# Altium schematic sheet TMTGP.SchDoc
size A3
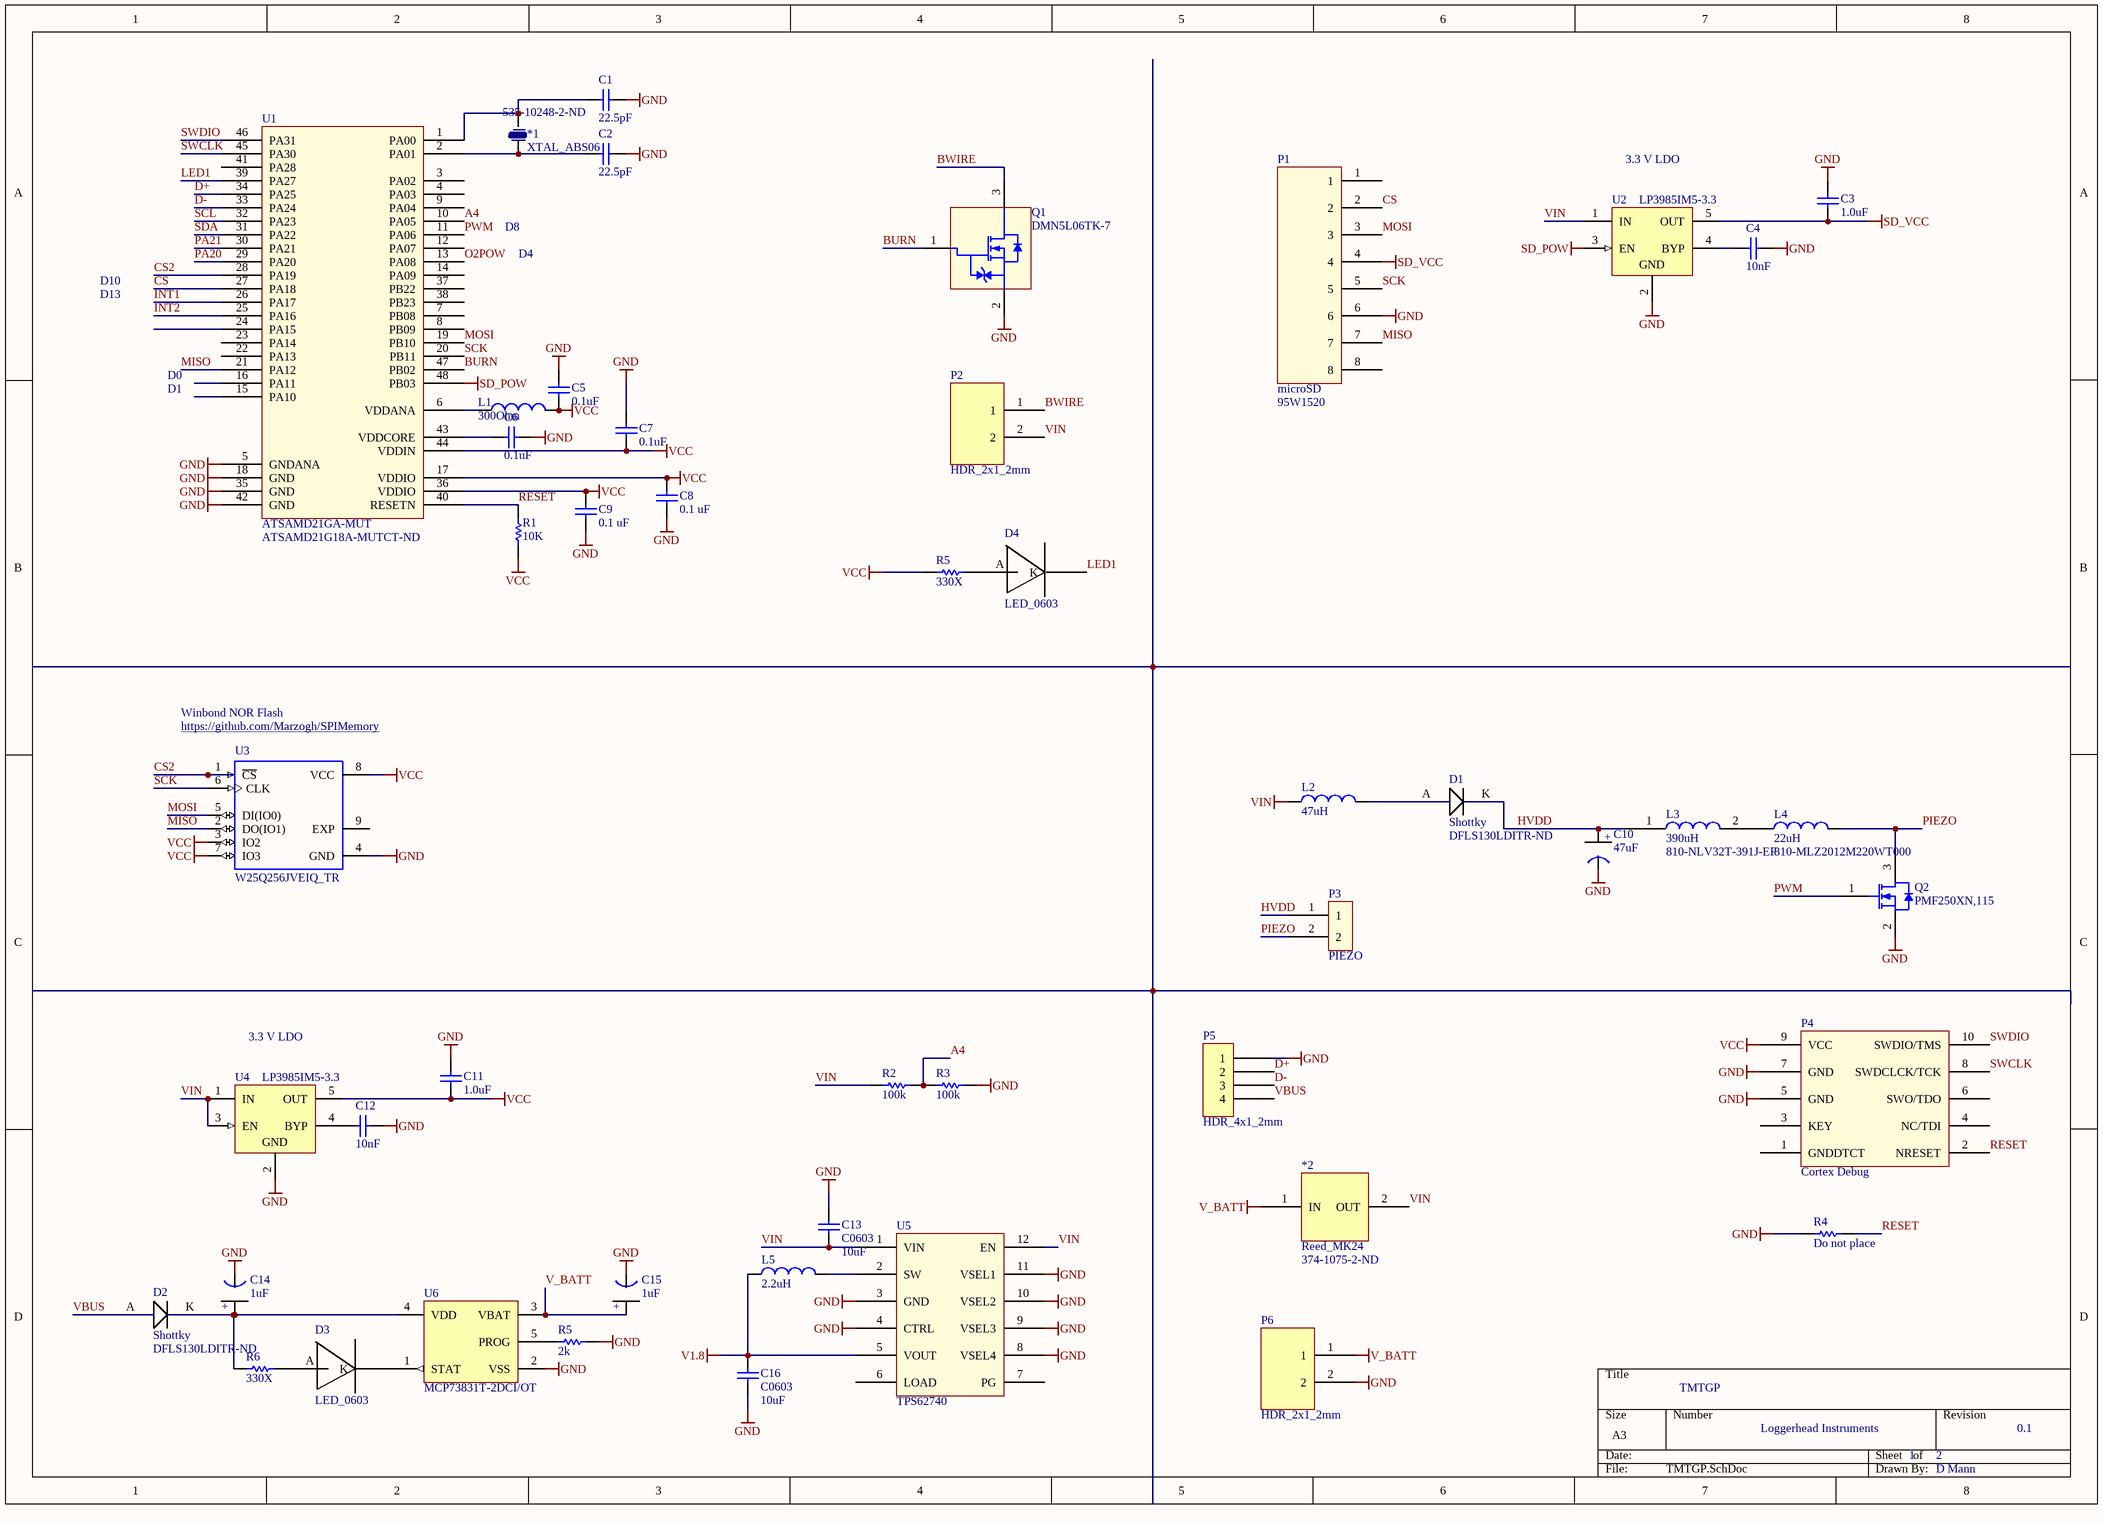
[diagram p0: TMTGP.SchDoc]

## Parts
(Parts that share a designator on the sheet are numbered #1, #2 ... from top to bottom, then left to right.)
*1  XTAL_ABS06  Supplier Part Number 1: 535-10248-2-ND  [XTAL-ABS06]
*2  Reed_MK24  Supplier Part Number 1: 374-1075-2-ND  [Reed MK24-B-3]
C1  22.5pF  [0402]
C2  22.5pF  [0402]
C3  1.0uF  [0402]
C4  10nF  [0402]
C5  0.1uF  [0402]
C6  0.1uF  [0402]
C7  0.1uF  [0402]
C8  0.1 uF  [0402]
C9  0.1 uF  [0402]
C10  47uF  [Tant0805]
C11  1.0uF  [0402]
C12  10nF  [0402]
C13  C0603  value 10uF  [0603]
C14  1uF  [Tant0805]
C15  1uF  [Tant0805]
C16  C0603  value 10uF  [0603]
D1  Shottky  Supplier Part Number 1: DFLS130LDITR-ND  [DFLS130]
D2  Shottky  Supplier Part Number 1: DFLS130LDITR-ND  [DFLS130]
D3  LED_0603  [Diode0603]
D4  LED_0603  [Diode0603]
L1  300Ohm  [0805 (M2125) Ferrite]
L2  47uH  [Inductor KLZ1608AHR]
L3  390uH  Supplier Part Number 1: 810-NLV32T-391J-EF  [Inductor_NLV32T]
L4  22uH  Supplier Part Number 1: 810-MLZ2012M220WT000  [Inductor MLZ2012M220WT000]
L5  2.2uH  [Inductor KLZ1608AHR]
P1  microSD  Supplier Part Number 1: 95W1520  [Molex microSD]
P2  HDR_2x1_2mm  [HDR_2x1_2mm]
P3  PIEZO  [PIEZO]
P4  Cortex Debug  [Header_2x5_50mil]
P5  HDR_4x1_2mm  [Hdr_4x1_2mm]
P6  HDR_2x1_2mm  [HDR_2x1_2mm]
Q1  DMN5L06TK-7  [SOT-523]
Q2  PMF250XN,115  [NXP-SOT323_N]
R1  10K  [3-0603]
R2  100k  [3-0603]
R3  100k  [3-0603]
R4  Do not place  [3-0603]
R5#1  330X  [3-0603]
R5#2  2k  [3-0603]
R6  330X  [3-0603]
U1  ATSAMD21GA-MUT  Supplier Part Number 1: ATSAMD21G18A-MUTCT-ND  [QFN127P600-8N]
U2  LP3985IM5-3.3  [MF05A_N]
U3  W25Q256JVEIQ_TR  [*SON127P800X600X80-9N]
U4  LP3985IM5-3.3  [MF05A_N]
U5  TPS62740  [TPS6274x]
U6  MCP73831T-2DCI/OT  [SOT-23-OT5_N]

## Nets
GND: C1.1 C2.1 C3.2 C4.1 C5.2 C6.2 C7.2 C8.2 C9.2 C10.1(GND) C11.2 C12.1 C13.2 C14.1(GND) C15.1(GND) C16.1 P1.6 P4.5(GND) P4.7(GND) P5.1 P6.2 Q1.2(S) Q2.2(S) R3.1 R4.2 R5#2.1 U1.5(GNDANA) U1.18(GND) U1.35(GND) U1.42(GND) U2.2(GND) U3.4(GND) U4.2(GND) U5.3(GND) U5.4(CTRL) U5.8(VSEL4) U5.9(VSEL3) U5.10(VSEL2) U5.11(VSEL1) U6.2(VSS)
SD_POW: U1.48(PB03) U2.3(EN)
SD_VCC: C3.1 P1.4 U2.5(OUT)
V1.8: C16.2 L5.1 U5.5(VOUT)
V_BATT: *2.1(IN) C15.2(+) P6.1 U6.3(VBAT)
VCC: C5.1 C7.1 C8.1 C9.1 C11.1 L1.2 P4.9(VCC) R1.1 R5#1.1 U1.17(VDDIO) U1.36(VDDIO) U1.44(VDDIN) U3.3(IO2) U3.7(IO3) U3.8(VCC) U4.5(OUT)
VIN: *2.2(OUT) C13.1 L2.1 P2.2 R2.2 U2.1(IN) U4.1(IN) U4.3(EN) U5.1(VIN) U5.12(EN)
A4: R2.1 R3.2 U1.10(PA05)
BURN: Q1.1(G) U1.47(PB02)
BWIRE: P2.1 Q1.3(D)
CS: P1.2 U1.27(PA18)
CS2: U1.28(PA19) U3.1(~{CS})
D+: P5.2 U1.34(PA25)
D-: P5.3 U1.33(PA24)
HVDD: C10.2(+) D1.K L3.1 P3.1
INT1: U1.26(PA17)
INT2: U1.25(PA16)
LED1: D4.K U1.39(PA27)
MISO: P1.7 U1.21(PA12) U3.2(DO(IO1))
MOSI: P1.3 U1.19(PB10) U3.5(DI(IO0))
O2POW: U1.13(PA08)
PA20: U1.29(PA20)
PA21: U1.30(PA21)
PIEZO: L4.2 P3.2 Q2.3(D)
PWM: Q2.1(G) U1.11(PA06)
RESET: P4.2(NRESET) R1.2 R4.1 U1.40(RESETN)
SCK: P1.5 U1.20(PB11) U3.6(CLK)
SCL: U1.32(PA23)
SDA: U1.31(PA22)
SWCLK: P4.8(SWDCLCK/TCK) U1.45(PA30)
SWDIO: P4.10(SWDIO/TMS) U1.46(PA31)
VBUS: D2.A P5.4
Net*1_1: *1.1 C2.2 U1.2(PA01)
Net*1_2: *1.2 C1.2 U1.1(PA00)
NetC4_2: C4.2 U2.4(BYP)
NetC6_1: C6.1 U1.43(VDDCORE)
NetC12_2: C12.2 U4.4(BYP)
NetC14_2: C14.2(+) D2.K R6.1 U6.4(VDD)
NetD1_A: D1.A L2.2
NetD3_A: D3.A R6.2
NetD3_K: D3.K U6.1(STAT)
NetD4_A: D4.A R5#1.2
NetL1_1: L1.1 U1.6(VDDANA)
NetL3_2: L3.2 L4.1
NetL5_2: L5.2 U5.2(SW)
NetR5#2_2: R5#2.2 U6.5(PROG)

Not connected (* = marked no-connect by the designer): P1 1 8; P4 1(GNDDTCT) 3(KEY) 4(NC/TDI) 6(SWO/TDO); U1 3(PA02) 4(PA03) 7(PB08) 8(PB09) 9(PA04) 12(PA07) 14(PA09) 15(PA10) 16(PA11) 22(PA13) 23(PA14) 24(PA15) 37(PB22) 38(PB23) 41(PA28); U3 9(EXP); U5 6(LOAD) 7(PG)

## Notes on the sheet
- 3.3 V LDO
- D8
- D10
- D13
- D4
- D0
- D1
- Winbond NOR Flash
- (near U3) https://github.com/Marzogh/SPIMemory
- TMTGP
- Loggerhead Instruments
- 1
- 2
- 0.1
- D Mann

## Library data of the parts
C1 C2 = C0402: Ceramic Chip Capacitor - Standard; Note: Footprint corresponds to dimensions for bulk cassette packaging. This case size has tightened tolerances.; Value: 12.5; Published: 17-Jul-2002; LatestRevisionDate: 19-Mar-2004; LatestRevisionNote: Silkscreen size reduced.; DatasheetDocument: Mar-2001; PackageDocument: Mar-2001; PackageReference: 0402; Publisher: Altium Limited; Code_JEITA: 0402; Code_IPC: 1005 [0402]; ComponentLink1Description: Manufacturer Link; ComponentLink1URL: http://www.kemet.com/; ComponentLink2Description: Datasheet; ComponentLink2URL: http://www.kemet.com/kemet/web/homepage/kechome.nsf/vapubfilesname/F3102TA.pdf/$file/F3102TA.pdf
C3-C7 C11 C12 = C0402: Ceramic Chip Capacitor - Standard; Note: Footprint corresponds to dimensions for bulk cassette packaging. This case size has tightened tolerances.; Published: 17-Jul-2002; LatestRevisionDate: 19-Mar-2004; LatestRevisionNote: Silkscreen size reduced.; DatasheetDocument: Mar-2001; PackageDocument: Mar-2001; PackageReference: 0402; Publisher: Altium Limited; Code_JEITA: 0402; Code_IPC: 1005 [0402]; ComponentLink1Description: Manufacturer Link; ComponentLink1URL: http://www.kemet.com/; ComponentLink2Description: Datasheet; ComponentLink2URL: http://www.kemet.com/kemet/web/homepage/kechome.nsf/vapubfilesname/F3102TA.pdf/$file/F3102TA.pdf
  C3 C11: Value: 1.0uF
  C4 C12: Value: 10nF
  C5-C7: Value: 0.1uF
C8 C9 = C0402: Ceramic Chip Capacitor - Standard; Note: Footprint corresponds to dimensions for bulk cassette packaging. This case size has tightened tolerances.; Value: 0.1uF; Published: 17-Jul-2002; LatestRevisionDate: 19-Mar-2004; LatestRevisionNote: Silkscreen size reduced.; DatasheetDocument: Mar-2001; PackageDocument: Mar-2001; PackageReference: 0402; Publisher: Altium Limited; Code_JEITA: 0402; Code_IPC: 1005 [0402]; ComponentLink1Description: Manufacturer Link; ComponentLink1URL: http://www.kemet.com/; ComponentLink2Description: Datasheet; ComponentLink2URL: http://www.kemet.com/kemet/web/homepage/kechome.nsf/vapubfilesname/F3102TA.pdf/$file/F3102TA.pdf
C10 = Tant0805: Value: 10uF
C13 C16 = C0603: Ceramic Chip Capacitor - Standard; Note: Footprint corresponds to dimensions for bulk cassette packaging. This case size has tightened tolerances.; Published: 17-Jul-2002; LatestRevisionDate: 19-Mar-2004; LatestRevisionNote: Silkscreen size reduced.; DatasheetDocument: Mar-2001; PackageDocument: Mar-2001; PackageReference: 0603; Publisher: Altium Limited; Code_JEITA: 0603; Code_IPC: 1608 [0603]; ComponentLink1Description: Manufacturer Link; ComponentLink1URL: http://www.kemet.com/; ComponentLink2Description: Datasheet; ComponentLink2URL: http://www.kemet.com/kemet/web/homepage/kechome.nsf/vapubfilesname/F3102TA.pdf/$file/F3102TA.pdf
C14 C15 = Tant0805: Value: *
D1 D2 = DFLS130: Supplier 1: Digi-Key
L1 = Ferrite 0805(M2125) 3A: Ferrite 25mOhm@DC,  60 Ohm@100MHz; Fabrication Tested: NO; Creator and Date: Design Engineer's Name; Footprint Verified By: *; Schematic Verified By: *; Vendor Info Verified By: *; Value: 300Ohm; HelpURL: http://www.yuden.co.jp/ut/product/pdf/mlci08_e.pdf; Mass (place origin at center): *; Supplier 1: Digi-Key; Supplier Part Number 1: 587-1932-1-ND; Supplier 2: Newark; Supplier Part Number 2: 73M9170
L2 L5 = Inductor KLZ1608: Supplier 1: Mouser; Supplier Part Number 1: 810-KLZ1608AHR2R2WTD
L3 = Inductor_NLV32T: Supplier 1: Mouser
L4 = Inductor MLZ2012M220WT000: Supplier 1: Mouser
P1 = microSD Molex tiny: Supplier 1: Newark
P4 = CortexDebug
Q1 = FET DMN5L06TK-7: Ultra-low leakage Enhanced MOSFET; Fabrication Tested: NO; Creator and Date: Will Flanery 2010-09-02; Footprint Verified By: *; Schematic Verified By: *; Vendor Info Verified By: *; Supplier 1: Digi-Key; Supplier Part Number 1: DMN5L06TKDICT-ND; HelpURL: http://www.diodes.com/datasheets/ds30926.pdf
Q2 = PMF250XN,115: N-Channel Trench MOSFET, 30 V, 0.9 A, -55 to 150 degC, 3-Pin SOT323, Tape and Reel; Manufacturer: NXP Semiconductors; Channel Type: N; Ciss [typ] (pF): 50; Coss [typ] (pF): 10; ID [max] (A): 0.9; Packing: Tape & Reel; VDS [max] (V): 30; VGSth [typ] (V): 1; DatasheetVersion: Rev. 1; PackageVersion: 06-03-16, 03/2006; PackageReference: SOT323; PackageDescription: 3-Pin Small Outline Transistor Package, Body 2 x 1.25 mm, Pitch 0.65 mm; Supplier 1: Digi-Key; Supplier Part Number 1: 568-10784-2-ND; Supplier 2: Digi-Key; Supplier Part Number 2: 568-10784-1-ND; Supplier 3: Digi-Key; Supplier Part Number 3: 568-10784-6-ND; Supplier 4: Mouser; Supplier Part Number 4: 771-PMF250XN,115; Mounting Technology: Surface Mount; Code_JEITA: SC-70; PartNumber: PMF250XN,115; ComponentLink1Description: Manufacturer URL; ComponentLink1URL: http://www.nxp.com/; ComponentLink2Description: Datasheet; ComponentLink2URL: http://www.nxp.com/documents/data_sheet/PMF250XN.pdf; ComponentLink3Description: Package Specification; ComponentLink3URL: http://www.nxp.com/documents/outline_drawing/sot323_po.pdf
R1-R4 R5#1 R5#2 R6 = ERJ3RK: Precision Thick Film Chip Resistor, 10 Ohm to 1M Ohm Range, 1% and 0.5% Tolerance, 0603 Size, 0.063 W; Published: 17-Dec-2003; LatestRevisionDate: 19-Mar-2004; LatestRevisionNote: Silkscreen size reduced.; PackageDocument: Mar-2003; PackageReference: 3-0603; Publisher: Altium Limited; Code_IPC: 1608 [0603]; ComponentLink1Description: Manufacturer Link; ComponentLink1URL: http://www.panasonic.com/industrial/components/resistive_products.htm; ComponentLink2Description: Datasheet; ComponentLink2URL: http://www.panasonic.com/industrial/components/pdf/AOA0000CE2.pdf
U1 = ATSAMD21G18: Supplier 1: Digi-Key
U2 U4 = LP3985IM5-3.3: Micropower, 150mA Low-Noise Ultra Low-Dropout CMOS Voltage Regulator, 5-pin SOT-23; Manufacturer: National Semiconductor; CompType: LDO IC; PackageTopMarking: LDQB*XTT; PowerWise: N; Published: 4-Dec-2008; DatasheetVersion: Aug-2005; PackageVersion: revD, Aug-2008; PackageReference: MF05A; Publisher: Altium Limited; PackageDescription: Molded SOT-23, .115 x .063 x .040 in Body, 5 Lead, .0375 in Pitch; PartNumber: LP3985IM5-3.3; RoHS: N; PinCount: 5; ComponentLink1Description: LP3985 Datasheet; ComponentLink1URL: http://www.national.com/ds/LP/LP3985.pdf; ComponentLink2Description: LP3985 Web Page; ComponentLink2URL: http://www.national.com/pf/LP/LP3985.html; ComponentLink3Description: MF05A Package Page; ComponentLink3URL: http://www.national.com/packaging/folders/mf05a.html; Supplier 1: Farnell; Supplier Part Number 1: 4418694
U3 = W25Q256JVEIQ_TR: Ic Flash 256mbit 104mhz 8wson; MF: Winbond; MP: W25Q256JVEIQ TR; SnapEDA_Link: https://www.snapeda.com/parts/W25Q256JVEIQ%20TR/Winbond%20Electronics/view-part/?ref=snap; Price: None; Availability: Unavailable; Package: WSON-8 Winbond; Value: *
U5 = TPS6274x: Supplier 1: Farnell
U6 = MCP73831T-2DCI/OT: Miniature Single-Cell, Fully Integrated Li-Ion, Li-Polymer Charge Management Controller, 4.2V, 5-Pin SOT-23, Industrial Temperature, Tape and Reel; DatasheetVersion: revE, Sep-2008; PackageVersion: revBB, Aug-2009; PackageReference: SOT-23-OT5; PackageDescription: 5-Lead Plastic Small Outline Transistor (OT) [SOT-23]; Code_IPC: SOT23-5; ComponentLink1Description: Manufacturer URL; ComponentLink1URL: http://www.microchip.com/; ComponentLink2Description: Datasheet; ComponentLink2URL: http://ww1.microchip.com/downloads/en/DeviceDoc/21984e.pdf; ComponentLink3Description: Package Specification; ComponentLink3URL: http://www.microchip.com/stellent/groups/techpub_sg/documents/packagingspec/en012702.pdf
*1 = XTAL_ABS06: Supplier 1: Digi-Key
*2 = Reed_MK24: Supplier 1: Digi-Key